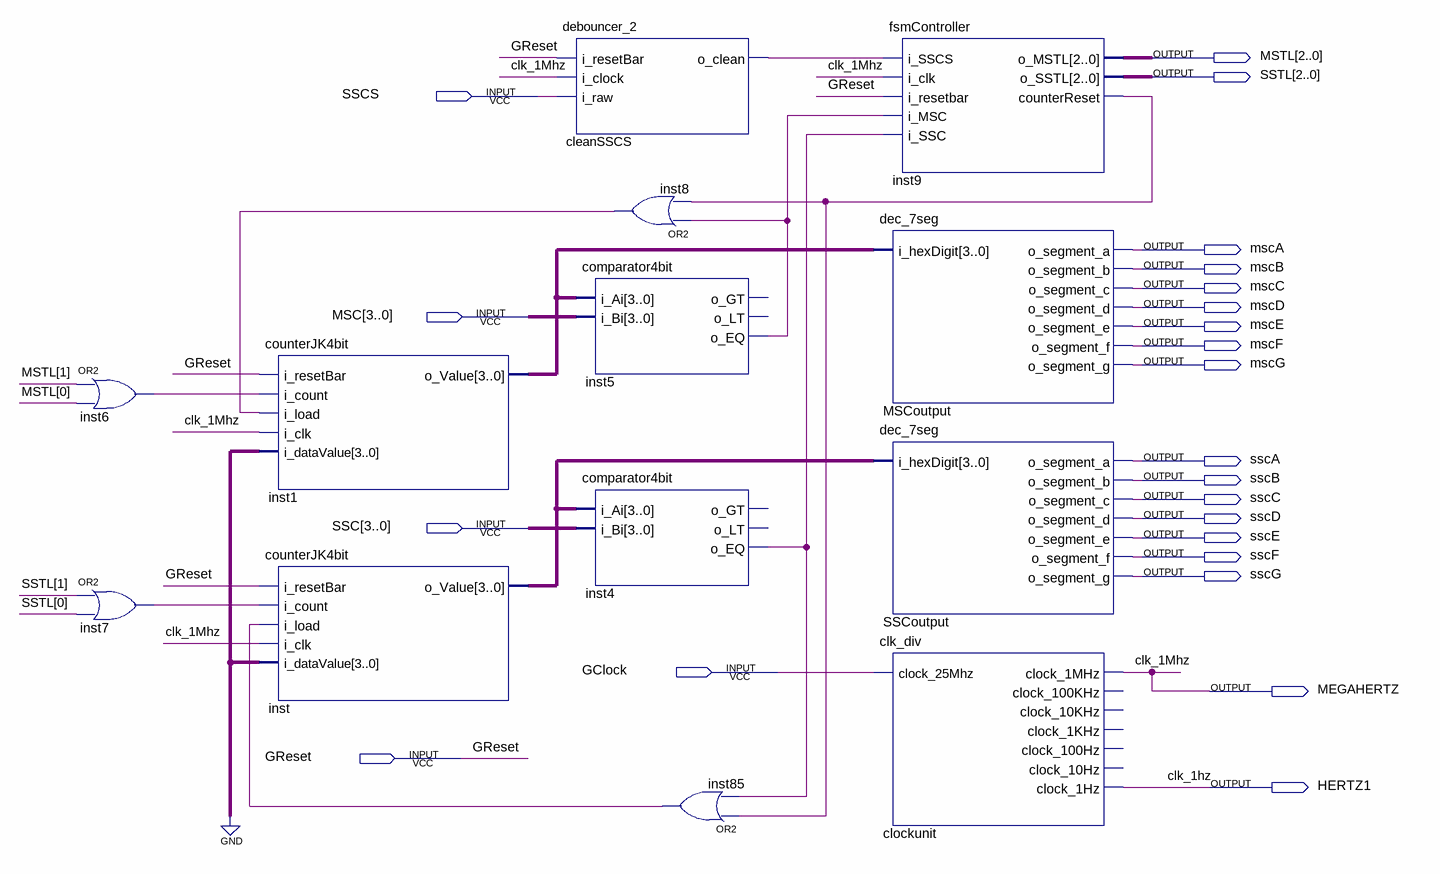
[diagram p0: schematic sheet]
// Quartus schematic lab3.bdf as structural Verilog: 13 symbols, 23 pins
module lab3 (
  input  SSCS,
  input  [3:0] MSC,
  input  [3:0] SSC,
  input  GClock,
  input  GReset,
  output [2:0] MSTL,
  output [2:0] SSTL,
  output mscA,
  output mscB,
  output mscC,
  output mscD,
  output mscE,
  output mscF,
  output mscG,
  output sscA,
  output sscB,
  output sscC,
  output sscD,
  output sscE,
  output sscF,
  output sscG,
  output MEGAHERTZ,
  output HERTZ1
);

  wire cleanSSCS_o_clean, inst4_o_eq, inst5_o_eq, inst6_out, inst7_out, inst8_out, inst9_counterreset,
       inst85_out;
  wire [3:0] inst1_o_value, inst_o_value;

  or inst6 (inst6_out, MSTL[1], MSTL[0]);
  or inst7 (inst7_out, SSTL[1], SSTL[0]);
  counterJK4bit inst1 (
    .i_resetBar(GReset), .i_count(inst6_out), .i_load(inst8_out), .i_clk(MEGAHERTZ), .i_dataValue(4'b0000),
    .o_Value(inst1_o_value));
  counterJK4bit inst (
    .i_resetBar(GReset), .i_count(inst7_out), .i_load(inst85_out), .i_clk(MEGAHERTZ), .i_dataValue(4'b0000),
    .o_Value(inst_o_value));
  debouncer_2 cleanSSCS (.i_resetBar(GReset), .i_clock(MEGAHERTZ), .i_raw(SSCS), .o_clean(cleanSSCS_o_clean));
  or inst8 (inst8_out, inst5_o_eq, inst9_counterreset);
  comparator4bit inst5 (.i_Ai(inst1_o_value), .i_Bi(MSC), .o_EQ(inst5_o_eq));  // open: o_GT, o_LT
  comparator4bit inst4 (.i_Ai(inst_o_value), .i_Bi(SSC), .o_EQ(inst4_o_eq));  // open: o_GT, o_LT
  or inst85 (inst85_out, inst9_counterreset, inst4_o_eq);
  fsmController inst9 (
    .i_SSCS(cleanSSCS_o_clean), .i_clk(MEGAHERTZ), .i_resetbar(GReset), .i_MSC(inst5_o_eq),
    .i_SSC(inst4_o_eq), .o_MSTL(MSTL), .o_SSTL(SSTL), .counterReset(inst9_counterreset));
  dec_7seg MSCoutput (
    .i_hexDigit(inst1_o_value), .o_segment_a(mscA), .o_segment_b(mscB), .o_segment_c(mscC),
    .o_segment_d(mscD), .o_segment_e(mscE), .o_segment_f(mscF), .o_segment_g(mscG));
  dec_7seg SSCoutput (
    .i_hexDigit(inst_o_value), .o_segment_a(sscA), .o_segment_b(sscB), .o_segment_c(sscC),
    .o_segment_d(sscD), .o_segment_e(sscE), .o_segment_f(sscF), .o_segment_g(sscG));
  clk_div clockunit (
    .clock_25Mhz(GClock), .clock_1MHz(MEGAHERTZ), .clock_1Hz(HERTZ1));  // open: clock_100KHz, clock_10KHz, clock_1KHz, clock_100Hz, clock_10Hz

  // Other names for the same wires on the sheet: clk_1hz = HERTZ1; clk_1Mhz = MEGAHERTZ
endmodule
